# Altium schematic sheet Main.SchDoc: Solar - ATMega + SubGHz
size A3; Address1: nmendi
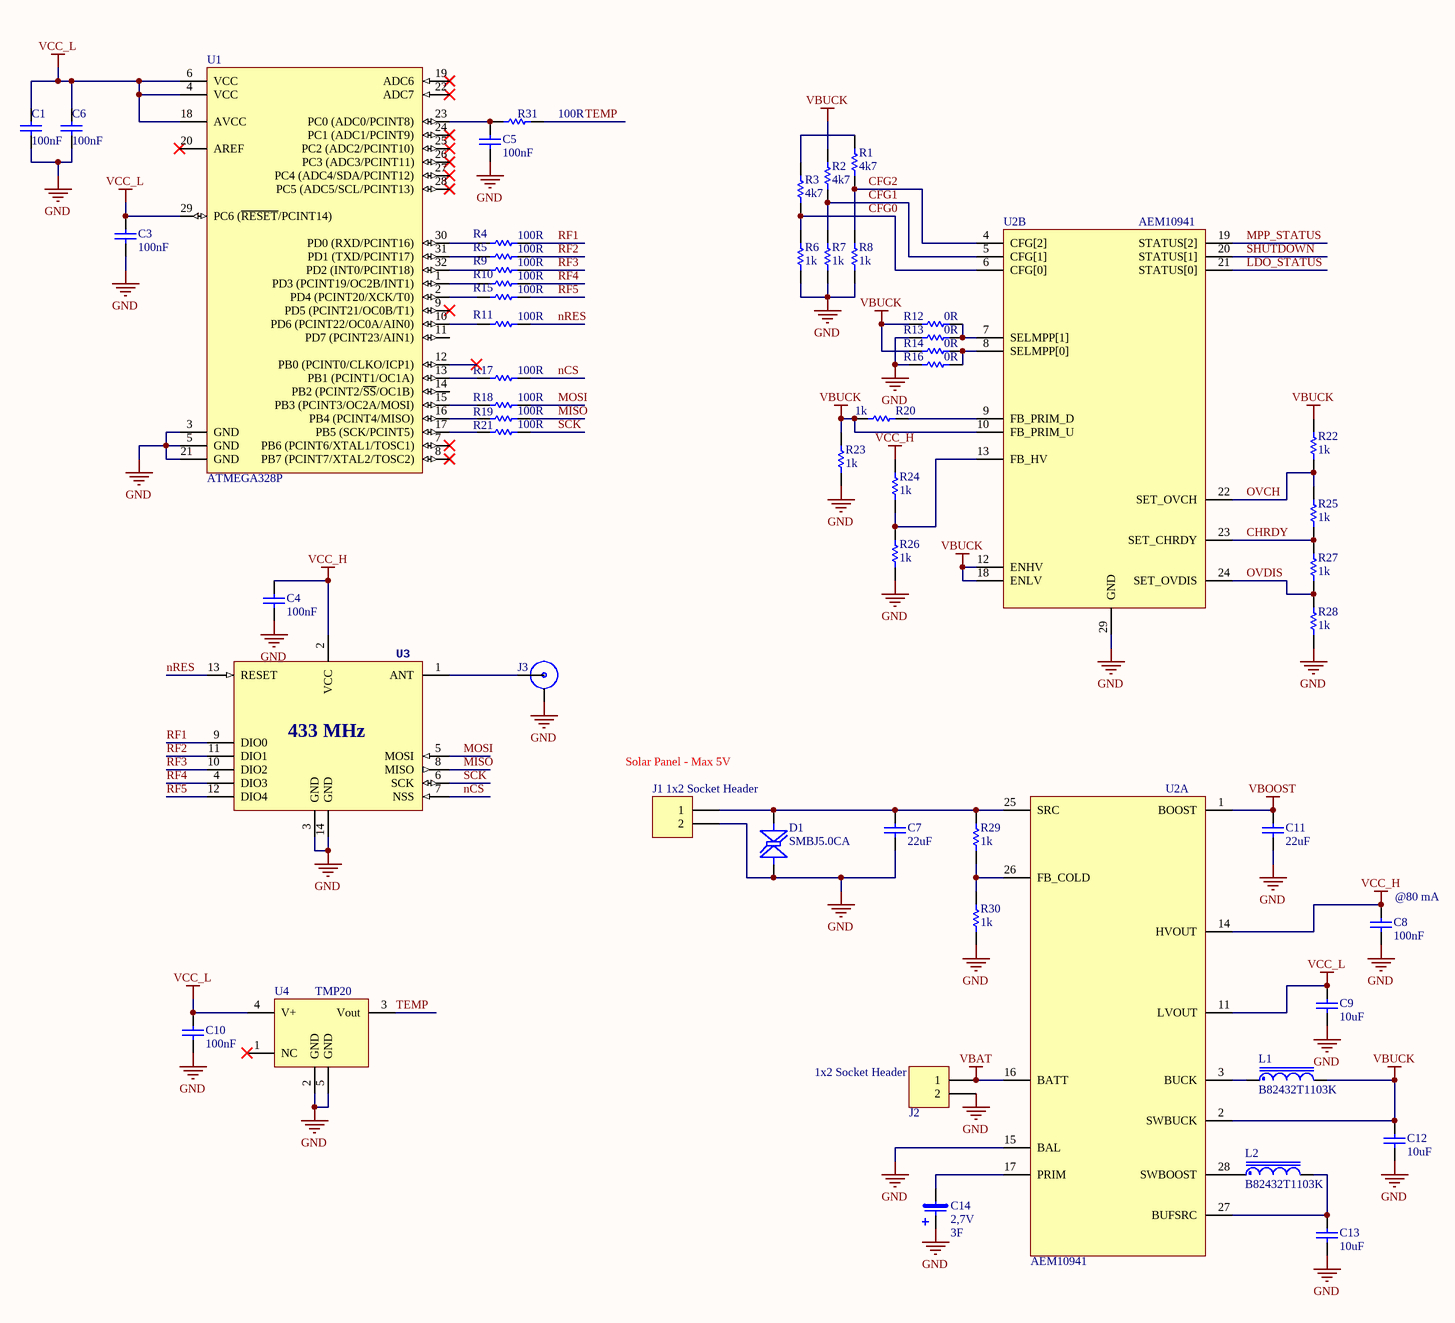
[diagram p0: Main.SchDoc]

## Parts
C1  value 100nF  [C0603]  (hidden comment: Capacitor)
C3  value 100nF  [C0603]  (hidden comment: Capacitor)
C4  value 100nF  [C0603]  (hidden comment: Capacitor)
C5  value 100nF  [C0603]  (hidden comment: Capacitor)
C6  value 100nF  [C0603]  (hidden comment: Capacitor)
C7  value 22uF  [C1206]  (hidden comment: Capacitor)
C8  value 100nF  [C0603]  (hidden comment: Capacitor)
C9  value 10uF  [C1206]  (hidden comment: Capacitor)
C10  value 100nF  [C0603]  (hidden comment: Capacitor)
C11  value 22uF  [C1206]  (hidden comment: Capacitor)
C12  value 10uF  [C1210]  (hidden comment: Capacitor)
C13  value 10uF  [C1210]  (hidden comment: Capacitor)
C14  Voltage: 2,7V  Capacitance: 3F  [WCAP-STSC_D8xH20mm]  (hidden comment: Electrolytic)
D1  SMBJ5.0CA  [DO-214AA]
J1  1x2 Socket Header  [MOLEX 22-05-7025]
J2  1x2 Socket Header  [MOLEX 22-05-7025]
J3  132322  [SMA_Edge_132322]  (value not drawn)
L1  B82432T1103K  [L1812-T]
L2  B82432T1103K  [L1812-T]
R1  value 4k7  [R0603]  (hidden comment: Resistor)
R2  value 4k7  [R0603]  (hidden comment: Resistor)
R3  value 4k7  [R0603]  (hidden comment: Resistor)
R4  value 100R  [R0603]  (hidden comment: Resistor)
R5  value 100R  [R0603]  (hidden comment: Resistor)
R6  value 1k  [R0603]  (hidden comment: Resistor)
R7  value 1k  [R0603]  (hidden comment: Resistor)
R8  value 1k  [R0603]  (hidden comment: Resistor)
R9  value 100R  [R0603]  (hidden comment: Resistor)
R10  value 100R  [R0603]  (hidden comment: Resistor)
R11  value 100R  [R0603]  (hidden comment: Resistor)
R12  value 0R  [R0603]  (hidden comment: Resistor)
R13  value 0R  [R0603]  (hidden comment: Resistor)
R14  value 0R  [R0603]  (hidden comment: Resistor)
R15  value 100R  [R0603]  (hidden comment: Resistor)
R16  value 0R  [R0603]  (hidden comment: Resistor)
R17  value 100R  [R0603]  (hidden comment: Resistor)
R18  value 100R  [R0603]  (hidden comment: Resistor)
R19  value 100R  [R0603]  (hidden comment: Resistor)
R20  value 1k  [R0603]  (hidden comment: Resistor)
R21  value 100R  [R0603]  (hidden comment: Resistor)
R22  value 1k  [R0603]  (hidden comment: Resistor)
R23  value 1k  [R0603]  (hidden comment: Resistor)
R24  value 1k  [R0603]  (hidden comment: Resistor)
R25  value 1k  [R0603]  (hidden comment: Resistor)
R26  value 1k  [R0603]  (hidden comment: Resistor)
R27  value 1k  [R0603]  (hidden comment: Resistor)
R28  value 1k  [R0603]  (hidden comment: Resistor)
R29  value 1k  [R0603]  (hidden comment: Resistor)
R30  value 1k  [R0603]  (hidden comment: Resistor)
R31  value 100R  [R0603]  (hidden comment: Resistor)
U1  ATMEGA328P  [QFN32]
U2  AEM10941  [QFN28]  (parts A,B of 2)
U3  433 MHz  [RFM69CW]  (value not drawn)
U4  TMP20  [SOT-563]

## Nets
GND: C1.1 C3.1 C4.1 C5.1 C6.1 C7.1 C8.1 C9.1 C10.1 C11.1 C12.1 C13.1 C14.1 D1.A J1.2 J2.2 J3.G R6.1 R7.1 R8.1 R13.1 R16.1 R23.2 R26.2 R28.1 R30.1 U1.3(GND) U1.5(GND) U1.21(GND) U2.15(BAL) U2.29(GND) U3.3(GND) U3.14(GND) U4.2(GND) U4.5(GND)
VBAT: J2.1 U2.16(BATT)
VBOOST: C11.2 U2.1(BOOST)
VBUCK: C12.2 L1.2 R2.2 R12.1 R14.1 R20.2 R22.2 R23.1 U2.2(SWBUCK) U2.10(FB_PRIM_U) U2.12(ENHV) U2.18(ENLV)
VCC_H: C4.2 C8.2 R24.1 U2.14(HVOUT) U3.2(VCC)
VCC_L: C1.2 C3.2 C6.2 C9.2 C10.2 U1.4(VCC) U1.6(VCC) U1.18(AVCC) U1.29(PC6_(~{RESET}/PCINT14)) U2.11(LVOUT) U4.4(V+)
CFG0: R3.1 R6.2 U2.6(CFG[0])
CFG1: R2.1 R7.2 U2.5(CFG[1])
CFG2: R1.1 R8.2 U2.4(CFG[2])
CHRDY: R25.1 R27.2 U2.23(SET_CHRDY)
LDO_STATUS: U2.21(STATUS[0])
MISO: R19.2 U3.8(MISO)
MOSI: R18.2 U3.5(MOSI)
MPP_STATUS: U2.19(STATUS[2])
nCS: R17.2 U3.7(NSS)
nRES: R11.2 U3.13(RESET)
OVCH: R22.1 R25.2 U2.22(SET_OVCH)
OVDIS: R27.1 R28.2 U2.24(SET_OVDIS)
RF1: R4.2 U3.9(DIO0)
RF2: R5.2 U3.11(DIO1)
RF3: R9.2 U3.10(DIO2)
RF4: R10.2 U3.4(DIO3)
RF5: R15.2 U3.12(DIO4)
SCK: R21.2 U3.6(SCK)
SHUTDOWN: U2.20(STATUS[1])
TEMP: R31.2 U4.3(Vout)
NetC5_2: C5.2 R31.1 U1.23(PC0_(ADC0/PCINT8))
NetC7_2: C7.2 D1.K J1.1 R29.2 U2.25(SRC)
NetC13_2: C13.2 L2.2 U2.27(BUFSRC)
NetC14_2: C14.2 U2.17(PRIM)
NetJ3_1: J3.1 U3.1(ANT)
NetL1_1: L1.1 U2.3(BUCK)
NetL2_1: L2.1 U2.28(SWBOOST)
NetR1_2: R1.2 R3.2
NetR4_1: R4.1 U1.30(PD0_(RXD/PCINT16))
NetR5_1: R5.1 U1.31(PD1_(TXD/PCINT17))
NetR9_1: R9.1 U1.32(PD2_(INT0/PCINT18))
NetR10_1: R10.1 U1.1(PD3_(PCINT19/OC2B/INT1))
NetR11_1: R11.1 U1.10(PD6_(PCINT22/OC0A/AIN0))
NetR12_2: R12.2 R13.2 U2.7(SELMPP[1])
NetR14_2: R14.2 R16.2 U2.8(SELMPP[0])
NetR15_1: R15.1 U1.2(PD4_(PCINT20/XCK/T0))
NetR17_1: R17.1 U1.13(PB1_(PCINT1/OC1A))
NetR18_1: R18.1 U1.15(PB3_(PCINT3/OC2A/MOSI))
NetR19_1: R19.1 U1.16(PB4_(PCINT4/MISO))
NetR20_1: R20.1 U2.9(FB_PRIM_D)
NetR21_1: R21.1 U1.17(PB5_(SCK/PCINT5))
NetR24_2: R24.2 R26.1 U2.13(FB_HV)
NetR29_1: R29.1 R30.2 U2.26(FB_COLD)

Not connected (* = marked no-connect by the designer): U1 7(PB6_(PCINT6/XTAL1/TOSC1))* 8(PB7_(PCINT7/XTAL2/TOSC2))* 9(PD5_(PCINT21/OC0B/T1))* 11(PD7_(PCINT23/AIN1)) 12(PB0_(PCINT0/CLKO/ICP1))* 14(PB2_(PCINT2/~{SS}/OC1B)) 19(ADC6)* 20(AREF)* 22(ADC7)* 24(PC1_(ADC1/PCINT9))* 25(PC2_(ADC2/PCINT10))* 26(PC3_(ADC3/PCINT11))* 27(PC4_(ADC4/SDA/PCINT12))* 28(PC5_(ADC5/SCL/PCINT13))*; U4 1(NC)*

## Notes on the sheet
- Solar Panel - Max 5V
- (near C8) @80 mA
- Title
- Size:
- Date:
- A4
- Number:
- Time:
- Revision:
- Sheet
- of
- File:

## Library data of the parts
C1 C3-C6 C8 C10 = C0603_100nF_16V_±10%: Capacitor SMD; Manufacturer: Kemet; Dielectric: X7R; Voltage: 16V; Tolerance: ±10%; OrderingCode: C0603C104K4RAC; Temp_ Max: 125; Temp_ Min: -55; Capacitance: 100nF; Part Number: C0603_100nF_16V_±10%; Supplier 1: Digikey; Supplier Part Number 1: 399-1096-1-ND; Price (€): 0,012
C7 = C1206_22uF_10V_±10%: Capacitor SMD; Manufacturer: Taiyo Yuden; Dielectric: X7R; Voltage: 10V; Tolerance: ±10%; OrderingCode: LMK316AB7226KL-TR; Temp_ Max: 125; Temp_ Min: -55; Capacitance: 22uF; Part Number: C1206_22uF_10V_±10%; Supplier 1: Mouser; Supplier Part Number 1: 963-LMK316AB7226KLTR; Supplier 2: Farnell; Price (€): 0,163
C9 = C1206_10uF_25V_±10%: Capacitor SMD; Manufacturer: Kemet; Dielectric: X7R; Voltage: 25V; Tolerance: ±10%; OrderingCode: C1206C106K3RACTU; Temp_ Max: 125; Temp_ Min: -55; Capacitance: 10uF; Part Number: C1206_10uF_25V_±10%; Supplier 1: Mouser; Supplier Part Number 1: 80-C1206C106K3R; Supplier 2: Farnell; Supplier Part Number 2: 2118134; Price (€): 0,5
C11 = C1206_22uF_25V_±10%: Capacitor SMD; Manufacturer: TDK; Dielectric: X5R; Voltage: 25V; Tolerance: ±10%; OrderingCode: C3216X5R1E226M160AB; Temp_ Max: 85; Temp_ Min: -55; Capacitance: 22uF; Part Number: C1206_22uF_25V_±10%; Supplier 1: Mouser; Supplier Part Number 1: 810-C3216X5R1E226M; Supplier 2: Farnell; Supplier Part Number 2: 2525169; Price (€): 0,8
C12 C13 = C1210_10uF_50V_±10%: Capacitor SMD; Manufacturer: Taiyo Yuden; Dielectric: X7R; Voltage: 50V; Tolerance: ±10%; OrderingCode: 885012209029; Temp_ Max: 125; Temp_ Min: -55; Capacitance: 10uF; Part Number: C1210_10uF_50V_±10%; Supplier 1: Mouser; Supplier Part Number 1: 710-885012209029; Supplier 2: Digi-Key; Supplier Part Number 2: 732-12289-1-ND
C14 = 850617030001: Capacitor, Electrolytic, THT; Manufacturer: Wurth; Value: 3F 2,7V; Temp_ Max: 65; Temp_ Min: -40; Part Number: 850617030001; OrderingCode: 850617030001; Supplier #1: Mouser; Supplier #1 Part Number: 710-850617030001; Supplier #2: Farnell; Supplier #2 Part Number: 2985561
D1 = TVS Bidir 5Vdc: Protection, Bidirectional Transient Suppression Diodes; Manufacturer: Littelfuse; Voltage: 5Vdc; Breakdown Voltage: 6,4 Vdc; Overvoltage Current: 65,3A; Temp_ Max: 150; Temp_ Min: -65; Part Number: TVS Bidir 5Vdc; OrderingCode: SMBJ5.0CA; Supplier 1: Mouser; Supplier Part Number 1: 576-SMBJ5.0CA; Supplier 2: Farnell; Supplier Part Number 2: 1827692; Price (€): 1827692
J1 J2 = Molex - 2 pin: Connector, 2 pin Socket Header; Manufacturer: Molex; Idc: 3A; OrderingCode: 22057025; Temp_Max: 105; Temp_Min: -40; Part Number: Molex - 2 pin; Supplier 1: Mouser; Supplier Part Number 1: 538-22-05-7025; Supplier 2: Farnell; Supplier Part Number 2: 9979670
J3 = SMA_Edge_132322: Coax; Manufacturer: FCI Amphenol; Part Number: SMA_Edge_132322; OrderingCode: 132322; Supplier 1: Mouser; Supplier Part Number 1: 523-132322; Supplier 2: Farnell; Price (€): 4,39
L1 L2 = 10uH_0,650A: Inductor, Power, SMD; Manufacturer: Epcos; L: 10uH; Rdc: 0,350R; Current: 0,650A; Temp_ Max: 85; Temp_ Min: -40; Value: 10uH 0,650A; Part Number: 10uH_0,650A; OrderingCode: B82432T1103K; Price (€): 0,48
R1-R3 = R0603_4k7_0.1W_±1%: Resistor, SMD; Manufacturer: Vishay; Tolerance: ±1%; OrderingCode: CRCW06034K70FK; Power: 0.1W; Temp_ Max: 155; Temp_ Min: -55; PackageDescription: SMD; Part Number: R0603_4k7_0.1W_±1%; Resistance: 4k7; Supplier 1: Mouser; Supplier Part Number 1: 71-CRCW0603-4.7K-E3; Supplier 2: Digikey; Supplier Part Number 2: 541-4.70KHDKR-ND; Price: 0,014
R4 R5 R9-R11 R15 R17-R19 R21 R31 = R0603_100R_0.1W_±1%: Resistor, SMD; Manufacturer: Vishay; Tolerance: ±1%; OrderingCode: CRCW0603100RFK; Power: 0.1W; Temp_ Max: 155; Temp_ Min: -55; PackageDescription: SMD; Part Number: R0603_100R_0.1W_±1%; Resistance: 100R; Supplier 1: Mouser; Supplier Part Number 1: 71-CRCW0603-100-E3; Supplier 2: Digikey; Supplier Part Number 2: 541-100HCT-ND; Price: 0,014
R6-R8 R20 R22-R30 = R0603_1k_0.1W_±1%: Resistor, SMD; Manufacturer: Vishay; Tolerance: ±1%; OrderingCode: CRCW06031K00FK; Power: 0.1W; Temp_ Max: 155; Temp_ Min: -55; PackageDescription: SMD; Part Number: R0603_1k_0.1W_±1%; Resistance: 1k; Supplier 1: Mouser; Supplier Part Number 1: 71-CRCW0603-1.0K-E3; Supplier 2: Digikey; Supplier Part Number 2: 541-1.00KHCT-ND; Price: 0,014
R12-R14 R16 = R0603_0R_0.1W_±5%: Resistor, SMD; Manufacturer: Vishay; Tolerance: ±5%; OrderingCode: CRCW06030000Z0; Power: 0.1W; Temp_ Max: 155; Temp_ Min: -55; PackageDescription: SMD; Part Number: R0603_0R_0.1W_±5%; Resistance: 0R; Price: 0,003
U1 = ATMEGA328P-QFN: Processor, 8-bit AVR Microcontroller; Manufacturer: Atmel; OrderingCode: ATMEGA328P-MU; Temp_ Max: 85; Temp_ Min: -40; Part Number: ATMEGA328P-QFN; Supplier #1: Mouser; Supplier #1 Part Number: 556-ATMEGA328P-MU; Supplier #2: Digi-Key; Supplier #2 Part Number: ATMEGA328P-MU-ND
U2 = AEM10941: Highly-efficient, regulated dual-output, ambient energy manager  for up to 7-cell solar panels with optional primary battery; Manufacturer: E-PEAS; Temp_ Max: 125; Temp_ Min: -40; Part Number: AEM10941; OrderingCode: AEM10941; Supplier 1: E-PEAS; Supplier Part Number 1: AEM10941
U3 = RFM69CW: RFM69CW SMD Wireless Transceiver - 433 MHz; Frequency: 433MHz; Part Number: RFM69CW; OrderingCode: RFM69CW; Supplier Part Number 1: RFM69CW
U4 = TMP20: TMP20 ±2.5°C Low-Power, Analog Out Temperature Sensor; Manufacturer: Texas Instruments; OrderingCode: TMP20AIDRLT; Temp_ Max: 125; Temp_ Min: -55; Part Number: TMP20; Supplier 1: Mouser; Supplier Part Number 1: 595-TMP20AIDRLT; Supplier 2: Farnell; Supplier Part Number 2: 1815753